# EAGLE design MAX31850K_breakout (EAGLE 6.6.0)
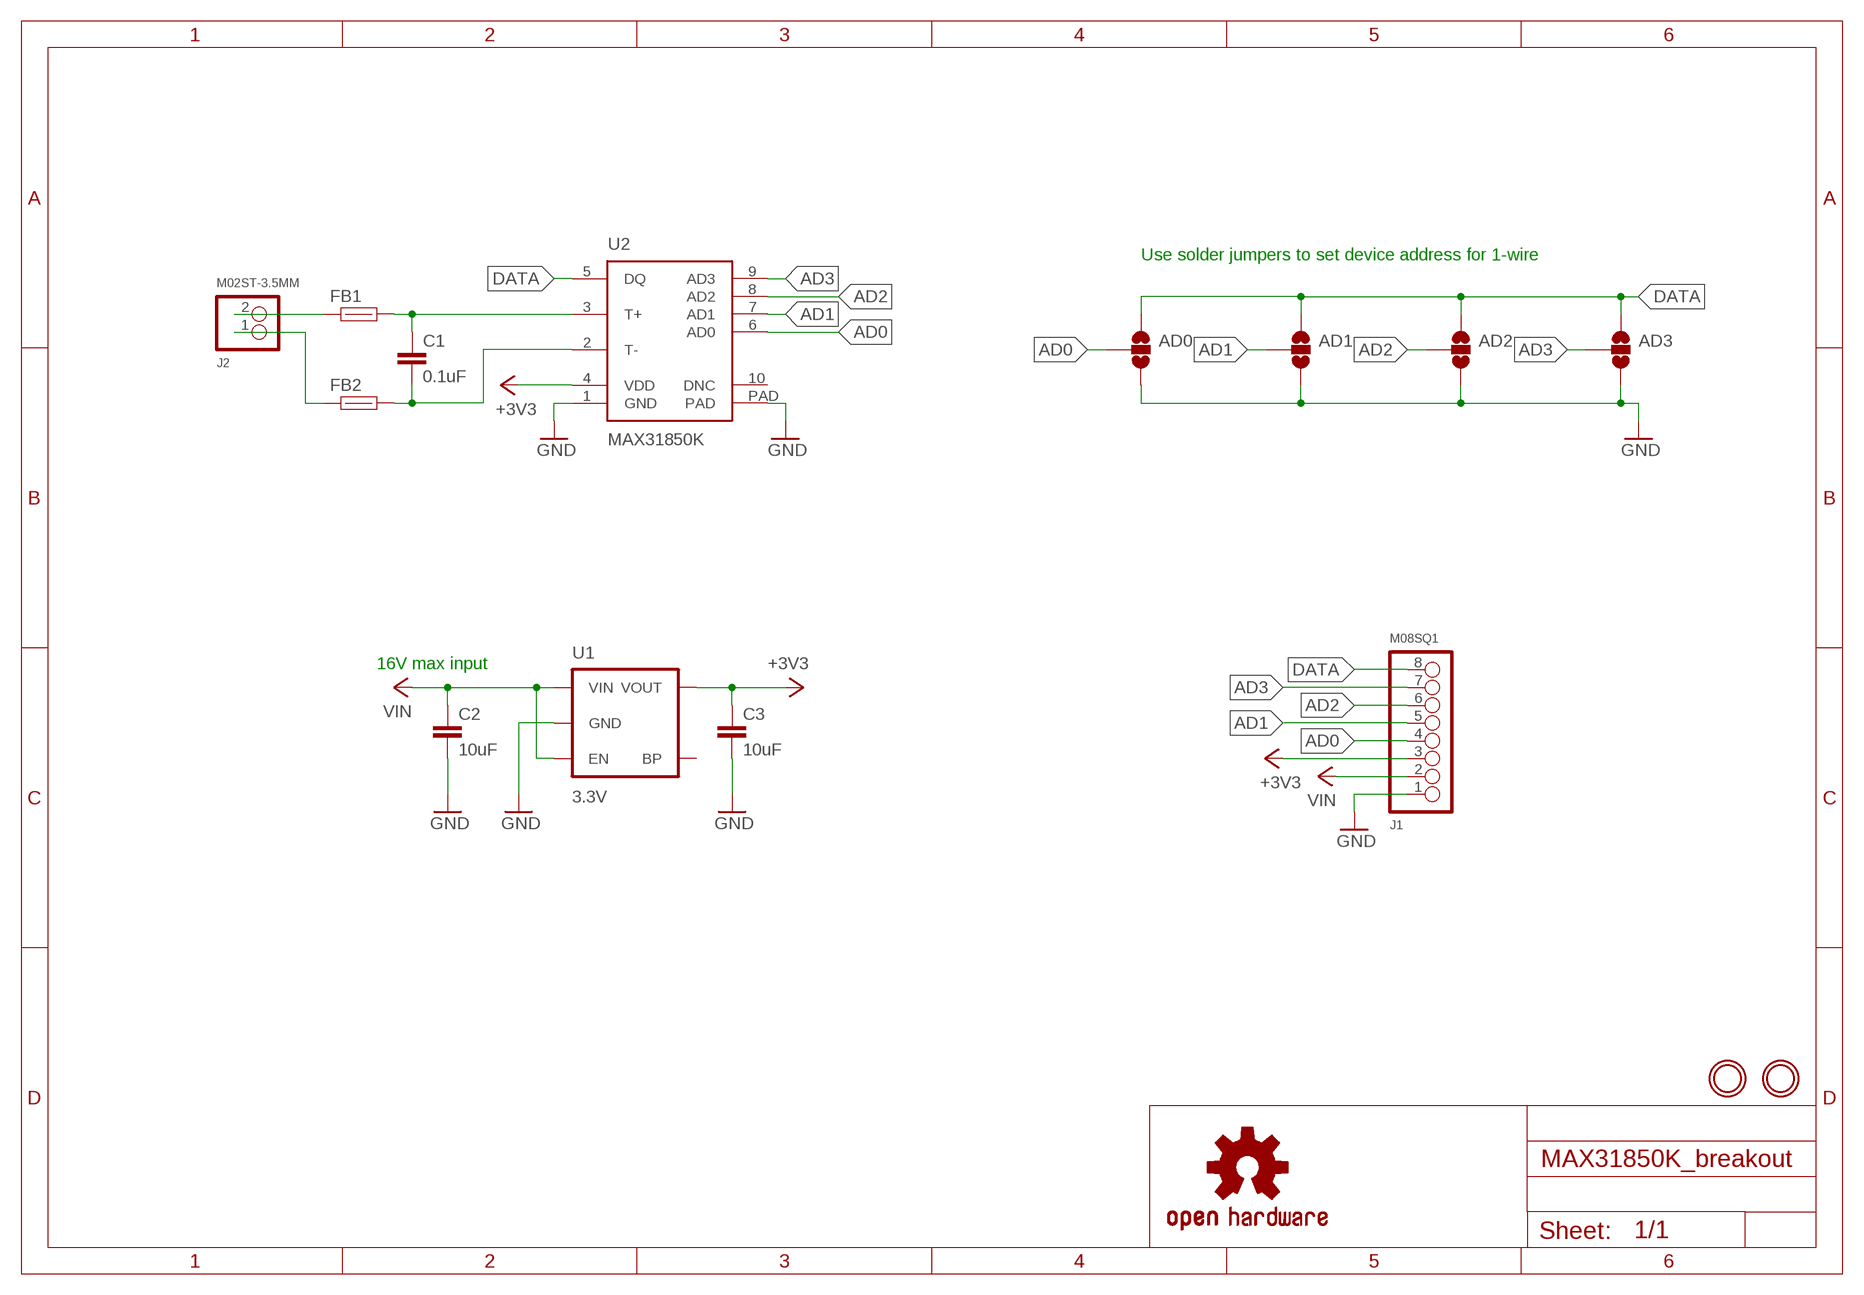
[diagram p0: schematic, sheet 1]

## Parts
AD0  SJ_2WAYS  [SJ_3]
AD1  SJ_2WAYS  [SJ_3]
AD2  SJ_2WAYS  [SJ_3]
AD3  SJ_2WAYS  [SJ_3]
C1  0.1uF  0.1UF-16V-0603  [0603-CAP]
C2  10uF  10UF-35V-1206  [1206-CAP]
C3  10uF  10UF-6.3V-0805  [0805-CAP]
FB1  FB-1K-100MHZ-0603  [0603-RES]
FB2  FB-1K-100MHZ-0603  [0603-RES]
J1  M08SQ1  [1X08_SQ1]
J2  M02ST-3.5MM  [SCREWTERMINAL-3.5MM-2]
LOGO1  OSHW-LOGOM  [OSHW-LOGO-M]
U1  3.3V  LP2985-33DBVR  [SOT23-5]
U2  MAX31850K  [10-TDFN-EP]
U$1  MNTHOLE-2.0  [MOUNTINGHOLE_2.0_PLATED]
U$2  MNTHOLE-2.0  [MOUNTINGHOLE_2.0_PLATED]

## Nets
+3V3: C3.P$1 J1.3 U1.5(VOUT) U2.4(VDD)
AD0: AD0.2 J1.4 U2.6(AD0)
AD1: AD1.2 J1.5 U2.7(AD1)
AD2: AD2.2 J1.6 U2.8(AD2)
AD3: AD3.2 J1.7 U2.9(AD3)
DATA: AD0.1 AD1.1 AD2.1 AD3.1 J1.8 U2.5(DQ)
GND: AD0.3 AD1.3 AD2.3 AD3.3 C2.P$4 C3.P$2 J1.1 U1.2(GND) U2.1(GND) U2.PAD
TM_FILT: C1.P$2 FB2.P$2 U2.2(T-)
TM_RAW: FB2.P$1 J2.1
TP_FILT: C1.P$1 FB1.P$2 U2.3(T+)
TP_RAW: FB1.P$1 J2.2
VIN: C2.P$3 J1.2 U1.1(VIN) U1.3(EN)
Unconnected: U1.4(BP) U2.10(DNC)

## Notes on the sheet
- Use solder jumpers to set device address for 1-wire
- 16V max input

## Library data of the parts
AD0 AD1-AD3 = LoganSmith-Connectors:SJ_2WAY: Solder Jumper 2 way solder jumper
C1 = LoganSmith-Capacitors:0.1UF-*-?: 0.1uF ceramic capacitors; DIGIKEY_OC: 1276-1005-1-ND; MFR: Samsung Electro-Mechanics America, Inc; MPN: CL10B104KO8NNNC; TEMP_COEFF: X7R; TEMP_RANGE: -55C to 125C; THICK: 0.90mm; TOL: +/-10%
C2 = LoganSmith-Capacitors:10UF-*-?; DIGIKEY_OC: 1276-3103-1-ND; MFR: Samsung Electro-Mechanics America, Inc; MPN: CL31B106KLHNNNE; TEMP_COEFF: X7R; TEMP_RANGE: -55C to 125C; THICK: 1.80mm; TOL: +/-10%
C3 = LoganSmith-Capacitors:10UF-*-?; DIGIKEY_OC: 1276-1113-1-ND; MFR: Samsung Electro-Mechanics America, Inc; MPN: CL21B106KQQNNNE; TEMP_COEFF: X7R; TEMP_RANGE: -55C to 125C; THICK: 1.40mm; TOL: +/-10%
FB1 FB2 = LoganSmith-Inductors:FB-1K-100MHZ-?: 1k@100MHz ferrite bead; CURRENT_RATING: 250mA; DC_RES: 600mOhm(max); DIGIKEY_OC: 1276-6378-1-ND; MFR: Samsung Electro-Mechanics America, Inc.; MPN: CIM10J102NC; THICK: 0.95mm; VALUE: 1kOhm@100MHz
J1 = LoganSmith-Connectors:M08?: 1x8 Headers
J2 = LoganSmith-Connectors:M02?: 1x2 Headers
LOGO1 = SparkFun-Aesthetics:OSHW-LOGO: Open Source Hardware Logo This logo indicates the piece of hardware it is found on incorporates a OSHW license and/or adheres to the definition of open source hardware found here: http://freedomdefined.org/OSHW
U1 = LoganSmith-Power_IC:LP2985*-?: Fixed output Texas Instruments LDO Datasheet <http://www.ti.com/lit/ds/symlink/lp2985-18.pdf> Features Output Tolerance of 1% (A Grade) 1.5% (Standard Grade) Ultra-Low Dropout, Typically 280 mV at Full Load of 150 mA 7 mV at 1 mA Wide VIN Range: 16 V Max; DIGIKEY_OC: 296-18476-1-ND; MFR: Texas Instruments; MPN: LP2985-33DBVR; TEMP_RANGE: -40C to 125C
U2 = LoganSmith-Digital_IC:MAX3185?*
U$1 U$2 = LoganSmith-Electromechanical:MNTHOLE-?

## Board
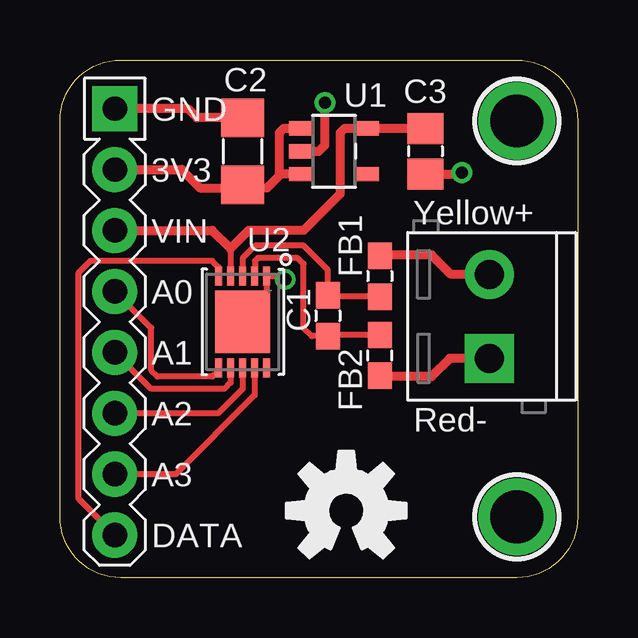
[diagram p1: board, top side]
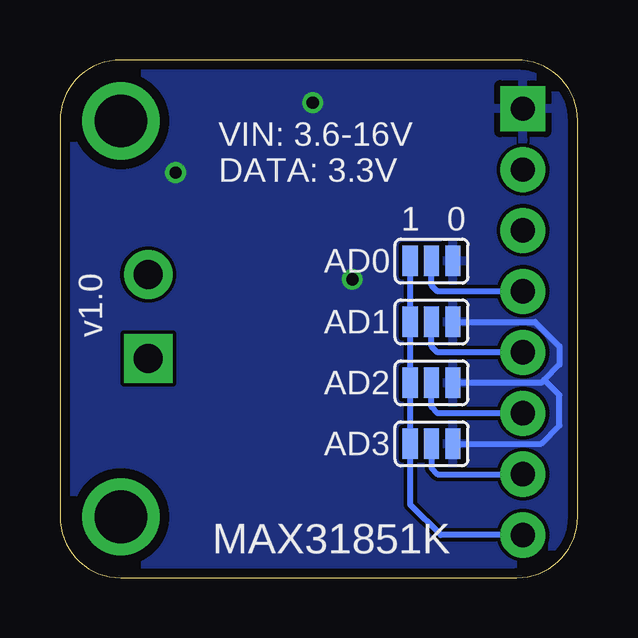
[diagram p2: board, bottom side, seen from below]

Size 21.59 x 21.59 mm. Coordinates in mm from the lower left corner, seen from the top.
Outline: 0,2.54 0,19.05 arc-90 2.54,21.59 19.05,21.59 arc-90 21.59,19.05 21.59,2.54 arc-90 19.05,0 2.54,0 arc-90 0,2.54
Copper layers (1*16): Top 0.0356mm / dielectric 1.5011mm / Bottom 0.0356mm
Design rules "OSHPark": minimum track width 6mil, minimum drill 13mil, track to track 6mil, track to pad 6mil, pad to pad 6mil, via to via 6mil, smd to smd 6mil, copper to edge 15mil, drill to drill 6mil, minimum pad ring 7mil, minimum via ring 7mil, stop-mask expansion 3mil, vias tented up to drill 0mil, thermal gap 10mil

### Footprints (pad centres in the part's own frame; a part is rotated, then mirrored left to right if it is on the bottom)
SJ_3 = smd 0.635 x 1.27: 1 -0.889,0; 2 0,0; 3 0.889,0
0603-CAP = smd 1.1 x 1: P$1 -0.85,0; P$2 0.85,0
1206-CAP = smd 1.6 x 1.8: P$3 -1.4,0; P$4 1.4,0
0805-CAP = smd 1.3 x 1.5: P$1 -0.95,0; P$2 0.95,0
0603-RES = smd 1.1 x 1: P$1 -0.85,0; P$2 0.85,0
1X08_SQ1 = drill 1.016 pad 1.88 square: 1 0,0 | drill 1.016 pad 1.88: 2 2.54,0; 3 5.08,0; 4 7.62,0; 5 10.16,0; 6 12.7,0; 7 15.24,0; 8 17.78,0
SCREWTERMINAL-3.5MM-2 = drill 1.2 pad 2.032 square: 1 0,0 | drill 1.2 pad 2.032: 2 3.5,0
SOT23-5 = smd 1.05 x 0.6: 1 -1.35,0.95; 2 -1.35,0; 3 -1.35,-0.95; 4 1.35,-0.95; 5 1.35,0.95
10-TDFN-EP = smd 0.79 x 0.3: 1 -1.92,1; 2 -1.92,0.5; 3 -1.92,0; 4 -1.92,-0.5; 5 -1.92,-1; 6 1.92,-1; 7 1.92,-0.5; 8 1.92,0; 9 1.92,0.5; 10 1.92,1 | smd 2.6 x 2.3: PAD 0,0
MOUNTINGHOLE_2.0_PLATED = drill 2.2 pad 3: P$1 0,0

### Placement (x,y rotation side)
AD0  6.1,13.21 0 bottom
AD1  6.1,10.67 0 bottom
AD2  6.1,8.13 0 bottom
AD3  6.1,5.59 0 bottom
C1  11.18,10.92 270 top
C2  7.62,17.78 90 top
C3  15.24,17.78 270 top
FB1  13.34,12.57 270 top
FB2  13.34,9.27 90 top
J1  2.29,19.56 270 top
J2  17.91,9.14 90 top
LOGO1  11.94,2.79 0 top
U1  11.43,17.78 0 top
U2  Type K  [10-TDFN-EP]  7.62,10.67 270 top
U$1  19.05,2.54 0 top
U$2  19.05,19.05 0 top

### Tracks (layer width: path | path; a pad name or v marks a point on that pad's centre or on a via)
+3V3
  Top 0.254: 7.11,13.72 U2.4
  Top 0.381: C3.P$1 U1.5 11.87,18.73 11.68,18.54 11.68,16 10.16,14.48 7.87,14.48 7.11,13.72 6.35,14.48 J1.3
AD0
  Top 0.254: U2.6 6.62,8.65 6.35,8.38 4.06,8.38 3.81,8.64 3.81,10.41 J1.4
  Bottom 0.254: J1.4 5.84,11.94 6.1,12.19 AD0.2
AD1
  Top 0.254: U2.7 7.12,8.14 6.86,7.87 3.81,7.87 J1.5
  Bottom 0.254: J1.5 5.84,9.4 6.1,9.65 AD1.2
AD2
  Top 0.254: U2.8 7.62,7.87 6.6,6.86 J1.6
  Bottom 0.254: J1.6 5.84,6.86 6.1,7.11 AD2.2
AD3
  Top 0.254: U2.9 8.12,7.61 4.83,4.32 J1.7
  Bottom 0.254: AD3.2 6.1,4.57 5.84,4.32 J1.7
DATA
  Top 0.254: U2.5 6.62,12.94 6.35,13.21 1.27,13.21 0.76,12.7 0.76,3.3 J1.8
  Bottom 0.254: AD0.1 AD1.1 AD2.1 AD3.1 6.99,3.05 5.71,1.78 J1.8
GND  (via drill 0.51)
  Top 0.254: v9.4,12.45 9.26,12.59 U2.1 8.62,11.7 8.64,11.68 U2.PAD
  Top 0.381: C2.P$4 5.71,19.18 5.33,19.56 J1.1 | U1.2 10.79,17.78 11.05,18.03 v11.05,19.81 | C3.P$2 16.7,16.83 v16.76,16.89
  Bottom 0.254: AD1.3 1.78,10.67 0.76,9.65 0.76,8.89 1.4,8.26 | 1.4,8.26 1.52,8.13 AD2.3 | AD3.3 1.52,5.59 0.76,6.35 0.76,7.62 1.4,8.26
  pour Bottom: 0,19.05 arc-90 2.54,21.59 19.05,21.59 arc-90 21.59,19.05 21.59,2.54 arc-90 19.05,0 2.54,0 arc-90 0,2.54
TM_FILT
  Top 0.254: FB2.P$2 11.22,10.12 C1.P$2 10.5,10.07 10.16,10.41 10.16,13.08 9.91,13.34 8.26,13.34 8.13,13.21 U2.2
TM_RAW
  Top 0.381: J2.1 16.26,9.14 15.49,8.38 13.37,8.38 FB2.P$1
TP_FILT
  Top 0.254: FB1.P$2 11.22,11.72 C1.P$1 11.18,12.83 10.16,13.84 8.13,13.84 7.62,13.34 U2.3
TP_RAW
  Top 0.381: J2.2 16.31,12.64 15.49,13.46 13.37,13.46 FB1.P$1
VIN
  Top 0.381: U1.3 9.21,16.83 | 9.21,16.83 8.64,16.26 7.75,16.26 C2.P$3 7.5,16.26 5.84,16.26 5.08,17.02 J1.2 | U1.1 9.33,18.73 9.14,18.54 9.14,16.9 9.21,16.83

### Text on the board
tPlace: GND | 3V3 | Yellow+ | VIN | A0 | A1 | A2 | Red- | A3 | DATA
bPlace: VIN: 3.6-16V / DATA: 3.3V | 0 | 1 | v1.0 | MAX31851K